# EAGLE design inkubator (EAGLE 9.6.2)
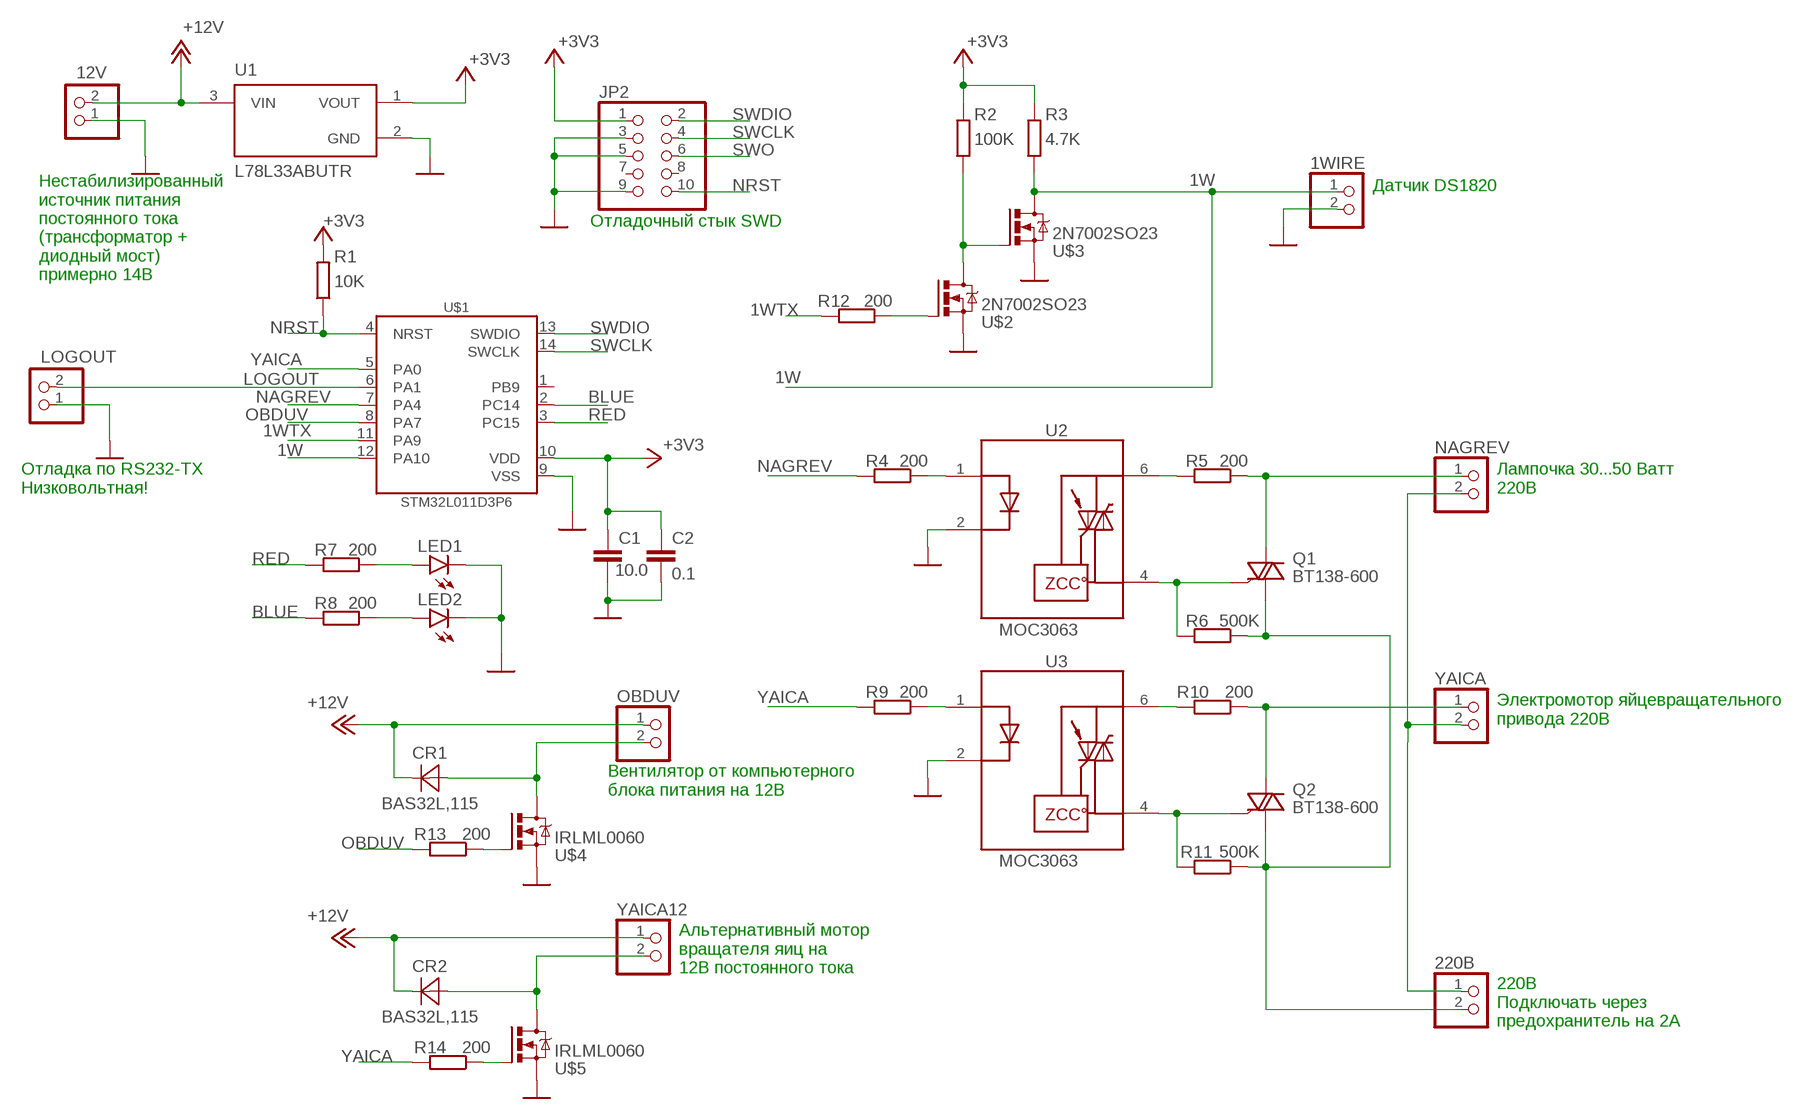
[diagram p0: schematic, sheet 1]

## Parts
1WIRE  PINHD-1X2  [1X02]
12V  PINHD-1X2  [1X02]
220В  PINHD-1X2  [1X02]
C1  10.0  C-EUC1206  [C1206]
C2  0.1  C-EUC1206  [C1206]
CR1  BAS32L,115  [SOD80C]
CR2  BAS32L,115  [SOD80C]
JP2  PINHD-2X5  [2X05]
LED1  LED10MM  [LED10MM]
LED2  LED10MM  [LED10MM]
LOGOUT  PINHD-1X2  [1X02]
NAGREV  PINHD-1X2  [1X02]
OBDUV  PINHD-1X2  [1X02]
Q1  BT138-600  T810-600B-TR  [DPAK]
Q2  BT138-600  T810-600B-TR  [DPAK]
R1  10K  R-EU_R0603  [R0603]
R2  100K  R-EU_R0603  [R0603]
R3  4.7K  R-EU_R0603  [R0603]
R4  200  R-EU_R0603  [R0603]
R5  200  R-EU_R1206  [R1206]
R6  500K  R-EU_R1206  [R1206]
R7  200  R-EU_R0603  [R0603]
R8  200  R-EU_R0603  [R0603]
R9  200  R-EU_R0603  [R0603]
R10  200  R-EU_R1206  [R1206]
R11  500K  R-EU_R1206  [R1206]
R12  200  R-EU_R0603  [R0603]
R13  200  R-EU_R0603  [R0603]
R14  200  R-EU_R0603  [R0603]
U1  L78L33ABUTR  L78L12ABUTR  [VREG_L78L12ABUTR]
U2  MOC3063  VO3062-X017T  [SOIC254P1030X460-6N]
U3  MOC3063  VO3062-X017T  [SOIC254P1030X460-6N]
U$1  STM32L011D3P6  [SOP65P640X120-14N]
U$2  2N7002SO23  [SOT23]
U$3  2N7002SO23  [SOT23]
U$4  IRLML0060  2N7002SO23  [SOT23]
U$5  IRLML0060  2N7002SO23  [SOT23]
YAICA  PINHD-1X2  [1X02]
YAICA12  PINHD-1X2  [1X02]

## Nets
1W: 1WIRE.1 R3.1 U$1.12(PA10) U$3.3(D)
1WTX: R12.2 U$1.11(PA9)
+3V3: C1.1 C2.1 JP2.1 R1.2 R2.2 R3.2 U1.1(VOUT) U$1.10(VDD)
+12V: 12V.2 CR1.1(CATHODE) CR2.1(CATHODE) OBDUV.1 U1.3(VIN) YAICA12.1
BLUE: R8.2 U$1.2(PC14)
GND: 1WIRE.2 12V.1 C1.2 C2.2 JP2.3 JP2.5 JP2.9 LED1.K(C) LED2.K(C) LOGOUT.1 U1.2(GND) U2.2(C) U3.2(C) U$1.9(VSS) U$2.2(S) U$3.2(S) U$4.2(S) U$5.2(S)
LOGOUT: LOGOUT.2 U$1.6(PA1)
N$1: R2.1 U$2.3(D) U$3.1(G)
N$2: R4.1 U2.1(A)
N$3: Q1.3(G) R6.2 U2.4(MT1)
N$4: R5.2 U2.6(MT2)
N$5: NAGREV.1 Q1.2(A2) R5.1
N$6: 220В.1 NAGREV.2 YAICA.2
N$7: R9.1 U3.1(A)
N$8: Q2.3(G) R11.2 U3.4(MT1)
N$9: LED1.A R7.1
N$10: LED2.A R8.1
N$11: R10.2 U3.6(MT2)
N$12: Q2.2(A2) R10.1 YAICA.1
N$13: 220В.2 Q1.1(A1) Q2.1(A1) R6.1 R11.1
N$14: R12.1 U$2.1(G)
N$15: R13.1 U$4.1(G)
N$16: CR1.2(ANODE) OBDUV.2 U$4.3(D)
N$17: R14.1 U$5.1(G)
N$18: CR2.2(ANODE) U$5.3(D) YAICA12.2
NAGREV: R4.2 U$1.7(PA4)
NRST: JP2.10 R1.1 U$1.4(NRST)
OBDUV: R13.2 U$1.8(PA7)
RED: R7.2 U$1.3(PC15)
SWCLK: JP2.4 U$1.14(SWCLK)
SWDIO: JP2.2 U$1.13(SWDIO)
SWO: JP2.6
YAICA: R9.2 R14.2 U$1.5(PA0)
Unconnected: JP2.7 JP2.8 U$1.1(PB9)

## Notes on the sheet
- Датчик DS1820
- Отладочный стык SWD
- Нестабилизированный 
  источник питания 
  постоянного тока
  (трансформатор + 
  диодный мост)
  примерно 14В
- Отладка по RS232-TX
  Низковольтная!
- Лампочка 30...50 Ватт
  220В
- Электромотор яйцевращательного 
  привода 220В
- Вентилятор от компьютерного 
  блока питания на 12В
- Альтернативный мотор 
  вращателя яиц на 
  12В постоянного тока
- 220В
  Подключать через 
  предохранитель на 2А

## Library data of the parts
1WIRE 12V 220В LOGOUT NAGREV OBDUV YAICA YAICA12 = pinhead:PINHD-1X2: PIN HEADER
C1 C2 = resistor:C-EU: CAPACITOR, European symbol
CR1 CR2 = BAS32L_115:BAS32L,115: Check availability <https://pricing.snapeda.com/parts/BAS32L%2C115/Nexperia%20USA/view-part?ref=eda>; AVAILABILITY: In Stock; DESCRIPTION: Diode Standard 75 V 200mA (DC) Surface Mount LLDS; MiniMelf; MF: Nexperia USA; MP: BAS32L,115; PACKAGE: LLDS-2 Nexperia USA Inc.; PRICE: None; PURCHASE-URL: https://pricing.snapeda.com/search/part/BAS32L,115/?ref=eda
JP2 = pinhead:PINHD-2X5: PIN HEADER
LED1 LED2 = led:LED: LED OSRAM: - CHIPLED LG R971, LG N971, LY N971, LG Q971, LY Q971, LO R971, LY R971 LH N974, LH R974 LS Q976, LO Q976, LY Q976 LO Q996 - Hyper CHIPLED LW Q18S LB Q993, LB Q99A, LB R99A - SideLED LS A670, LO A670, LY A670, LG A670, LP A670 LB A673, LV A673, LT A673, LW A673 LH A674 LY A675 LS A676, LA A676, LO A676, LY A676, LW A676 LS A679, LY A679, LG A679 - Hyper Micro SIDELED® LS Y876, LA Y876, LO Y876, LY Y876 LT Y87S - SmartLED LW L88C, LW L88S LB L89C, LB L89S, LG L890 LS L89K, LO L89K, LY L89K LS L896, LA L896, LO L896, LY L896 - TOPLED LS T670, LO T670, LY T670, LG T670, LP T670 LSG T670, LSP T670, LSY T670, LOP T670, LYG T670 LG T671, LOG T671, LSG T671 LB T673, LV T673, LT T673, LW T673 LH T674 LS T676, LA T676, LO T676, LY T676, LB T676, LH T676, LSB T676, LW T676 LB T67C, LV T67C, LT T67C, LS T67K, LO T67K, LY T67K, LW E67C LS E67B, LA E67B, LO E67B, LY E67B, LB E67C, LV E67C, LT E67C LW T67C LS T679, LY T679, LG T679 LS T770, LO T770, LY T770, LG T770, LP T770 LB T773, LV T773, LT T773, LW T773 LH T774 LS E675, LA E675, LY E675, LS T675 LS T776, LA T776, LO T776, LY T776, LB T776 LHGB T686 LT T68C, LB T68C - Hyper Mini TOPLED® LB M676 - Mini TOPLED Santana® LG M470 LS M47K, LO M47K, LY M47K Source: http://www.osram.convergy.de LUXEON: - LUMILED® LXK2-PW12-R00, LXK2-PW12-S00, LXK2-PW14-U00, LXK2-PW14-V00 LXK2-PM12-R00, LXK2-PM12-S00, LXK2-PM14-U00 LXK2-PE12-Q00, LXK2-PE12-R00, LXK2-PE12-S00, LXK2-PE14-T00, LXK2-PE14-U00 LXK2-PB12-K00, LXK2-PB12-L00, LXK2-PB12-M00, LXK2-PB14-N00, LXK2-PB14-P00, LXK2-PB14-Q00 LXK2-PR12-L00, LXK2-PR12-M00, LXK2-PR14-Q00, LXK2-PR14-R00 LXK2-PD12-Q00, LXK2-PD12-R00, LXK2-PD12-S00 LXK2-PH12-R00, LXK2-PH12-S00 LXK2-PL12-P00, LXK2-PL12-Q00, LXK2-PL12-R00 Source: www.luxeon.com KINGBRIGHT: KA-3528ASYC Source: www.kingbright.com
Q1 Q2 = T810-600B-TR:T810-600B-TR: Check availability <https://pricing.snapeda.com/parts/T810-600B-TR/STMicroelectronics/view-part?ref=eda>; AVAILABILITY: In Stock; DESCRIPTION: TRIAC Logic - Sensitive Gate 600 V 8 A Surface Mount DPAK; MF: STMicroelectronics; MP: T810-600B-TR; PACKAGE: TO-252 STMicroelectronics; PRICE: None; PURCHASE-URL: https://pricing.snapeda.com/search/part/T810-600B-TR/?ref=eda
R1-R14 = resistor:R-EU_: RESISTOR, European symbol
U1 = L78L12ABUTR:L78L12ABUTR: Linear Voltage Regulator IC 1 Output 100mA SOT-89-3 Check availability <https://pricing.snapeda.com/parts/L78L12ABUTR/STMicroelectronics/view-part?ref=eda>; AVAILABILITY: In Stock; DESCRIPTION: Linear Voltage Regulator IC Positive Fixed 1 Output 100mA SOT-89-3; MF: STMicroelectronics; MP: L78L12ABUTR; PACKAGE: SOT-89-3 STMicroelectronics; PRICE: None; PURCHASE-URL: https://pricing.snapeda.com/search/part/L78L12ABUTR/?ref=eda
U2 U3 = VO3062-X017T:VO3062-X017T: Phototriac, Zero Crossing, 1.5 kV/μs dV/dt, 600 V Check availability <https://pricing.snapeda.com/parts/VO3062-X017T/Vishay%20Semiconductor/view-part?ref=eda>; AVAILABILITY: In Stock; DESCRIPTION: Optoisolator Triac Output 5300Vrms 1 Channel 6-SMD; MF: Vishay Semiconductor; MP: VO3062-X017T; PACKAGE: SMD-6 Vishay Semiconductor; PRICE: None; PURCHASE-URL: https://pricing.snapeda.com/search/part/VO3062-X017T/?ref=eda
U$1 = stm32l011d3p6:STM32L011D3P6
U$2-U$5 = 2n7002:2N7002

## Board
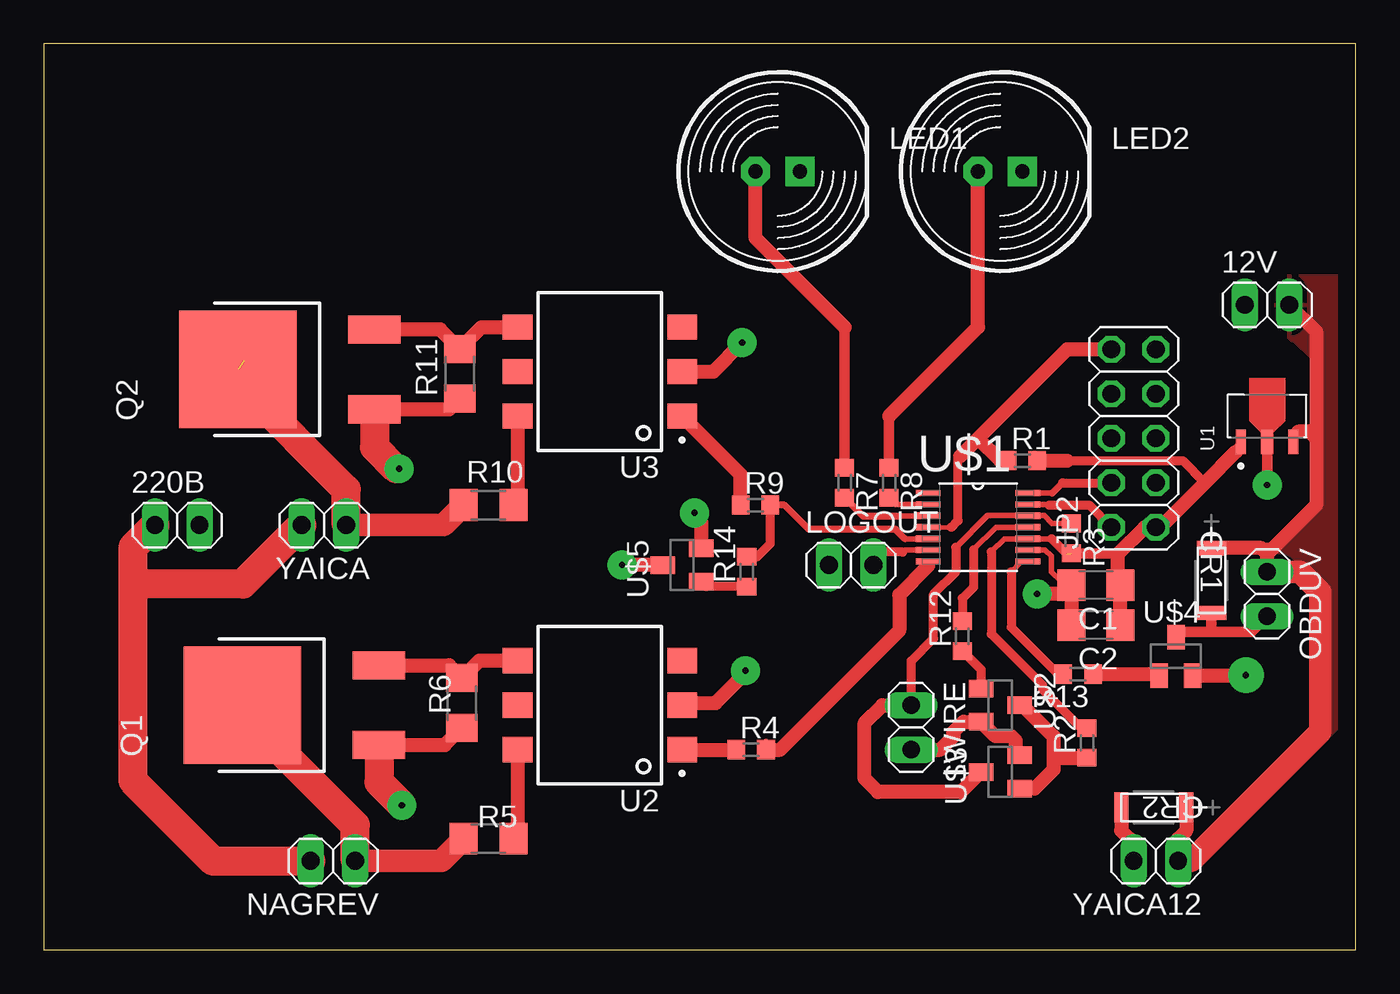
[diagram p1: board, top side]
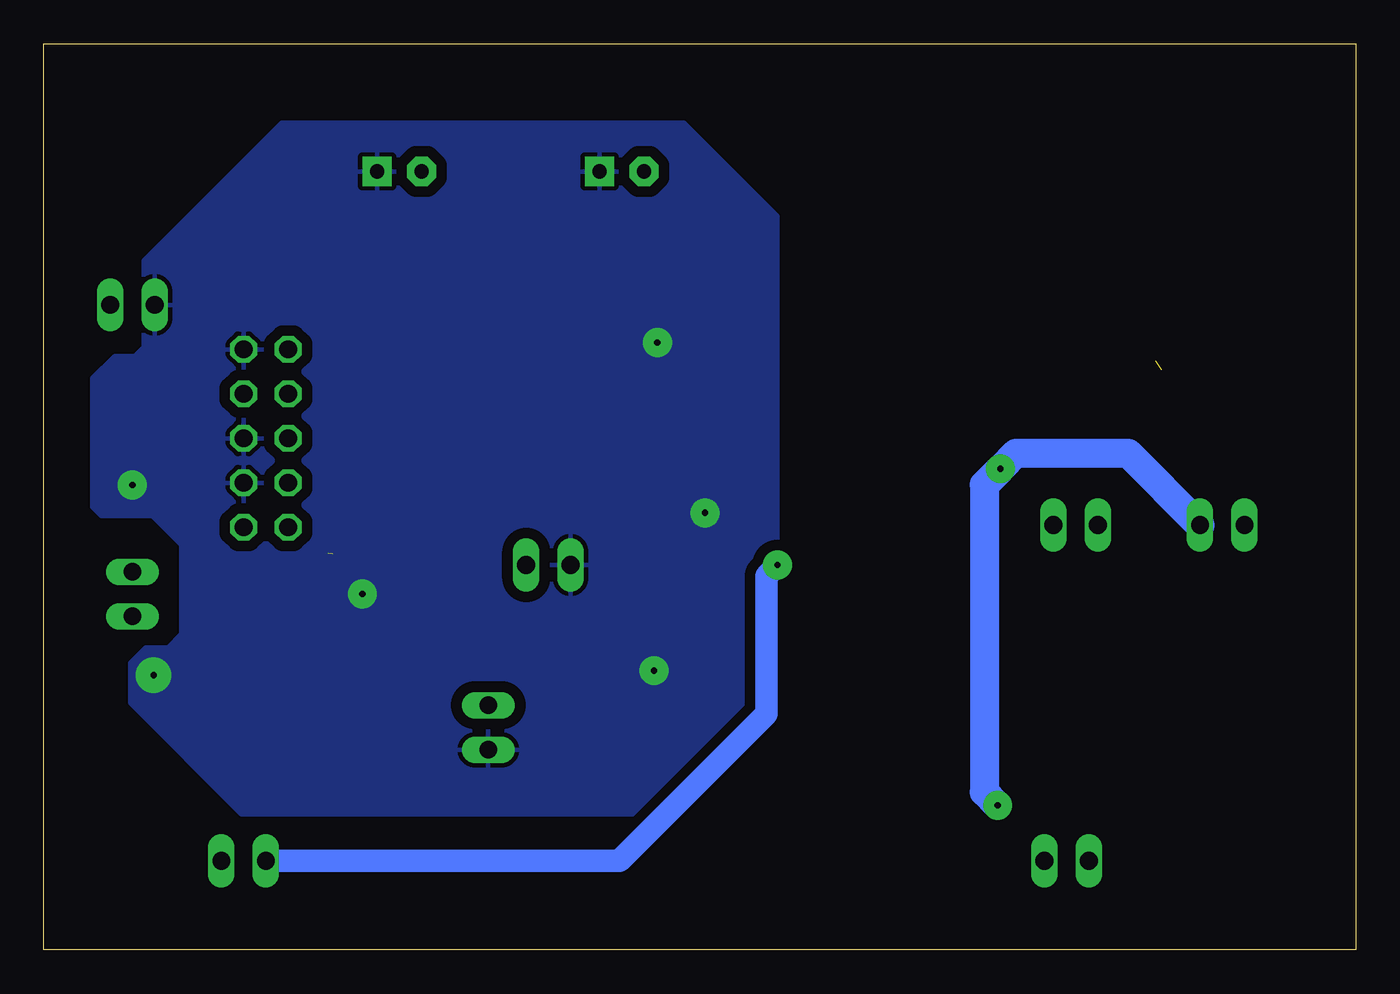
[diagram p2: board, bottom side, seen from below]

Size 74.91 x 51.74 mm. Coordinates in mm from the lower left corner, seen from the top.
Outline: 0,0 74.91,0 74.91,51.74 0,51.74 0,0
Copper layers (1*16): Top 0.035mm / dielectric 1.5mm / Bottom 0.035mm
Design rules "default": minimum track width 6mil, minimum drill 0.35mm, track to track 6mil, track to pad 6mil, pad to pad 6mil, via to via 6mil, smd to smd 6mil, copper to edge 40mil, drill to drill 6mil, minimum pad ring 10mil, minimum via ring 8mil, stop-mask expansion 4mil, vias tented up to drill 0mil, thermal gap 10mil

### Footprints (pad centres in the part's own frame; a part is rotated, then mirrored left to right if it is on the bottom)
1X02 = drill 1.016 long: 1 -1.27,0; 2 1.27,0
C1206 = smd 1.6 x 1.8: 1 -1.4,0; 2 1.4,0
SOD80C = smd 0.813 x 1.702: 1 -1.852,0; 2 1.852,0
2X05 = drill 1.016 octagon: 1 -5.08,-1.27; 2 -5.08,1.27; 3 -2.54,-1.27; 4 -2.54,1.27; 5 0,-1.27; 6 0,1.27; 7 2.54,-1.27; 8 2.54,1.27; 9 5.08,-1.27; 10 5.08,1.27
LED10MM = drill 0.813 pad 1.676 octagon: A -1.27,0 | drill 0.813 pad 1.676 square: K 1.27,0
DPAK = smd 1.6 x 3: 1 -2.28,-3.9; 3 2.28,-3.9 | smd 6.7 x 6.7: 2 0,3.9
R0603 = smd 1 x 1.1: 1 -0.85,0; 2 0.85,0
R1206 = smd 1.6 x 1.803: 1 -1.422,0; 2 1.422,0
VREG_L78L12ABUTR = smd 1.4 x 0.57: 1 -1.475,1.5; 3 -1.475,-1.5 | smd 1.4 x 0.65: 2 -1.475,0
SOIC254P1030X460-6N = smd 1.7 x 1.45: 1 -4.7,2.54; 2 -4.7,0; 3 -4.7,-2.54; 4 4.7,-2.54; 5 4.7,0; 6 4.7,2.54
SOP65P640X120-14N = smd 1.422 x 0.356: 1 -2.845,1.956; 2 -2.845,1.295; 3 -2.845,0.66; 4 -2.845,0; 5 -2.845,-0.66; 6 -2.845,-1.295; 7 -2.845,-1.956; 8 2.845,-1.956; 9 2.845,-1.295; 10 2.845,-0.66; 11 2.845,0; 12 2.845,0.66; 13 2.845,1.295; 14 2.845,1.956
SOT23 = smd 1 x 1.4: 1 -0.95,-1.1; 2 0.95,-1.1; 3 0,1.1

### Placement (x,y rotation side)
1WIRE  49.53,12.7 270 top
12V  69.85,36.83 0 top
220В  7.62,24.26 0 top
C1  60.07,20.83 180 top
C2  60.07,18.54 180 top
CR1  66.67,21.08 270 top
CR2  63.37,8.13 180 top
JP2  62.23,29.21 90 top
LED1  41.91,44.45 0 top
LED2  54.61,44.45 0 top
LOGOUT  46.1,21.97 0 top
NAGREV  16.51,5.08 180 top
OBDUV  69.85,20.32 270 top
Q1  15.24,13.97 90 top
Q2  14.99,33.15 90 top
R1  55.88,27.94 0 top
R2  59.56,11.81 90 top
R3  58.67,23.5 270 top
R4  40.39,11.43 0 top
R5  25.4,6.35 0 top
R6  23.88,14.1 90 top
R7  45.72,26.67 270 top
R8  48.26,26.67 270 top
R9  40.64,25.4 0 top
R10  25.4,25.4 0 top
R11  23.75,32.89 90 top
R12  52.45,17.91 90 top
R13  59.05,15.75 180 top
R14  40.13,21.59 90 top
U1  69.85,30.48 90 top
U2  31.75,13.97 180 top
U3  31.75,33.02 180 top
U$1  53.34,24.13 0 top
U$2  54.61,13.97 270 top
U$3  54.61,10.16 90 top
U$4  64.64,16.76 0 top
U$5  36.45,21.97 90 top
YAICA  16,24.26 180 top
YAICA12  63.5,5.08 180 top

### Tracks (layer width: path | path; a pad name or v marks a point on that pad's centre or on a via)
1W
  Top 0.305: 52.07,22.99 53.87,24.79 U$1.12 57.12,24.79 57.57,24.34 R3.1
  Top 0.508: 52.07,22.99 52.07,21.59 50.8,20.32 50.8,17.78 49.53,16.51 1WIRE.1
  Top 0.813: U$3.3 52.37,9.02 47.62,9.02 46.86,9.78 46.86,12.95 47.88,13.97 1WIRE.1
1WTX
  Top 0.305: U$1.11 54.36,24.13 53.09,22.86
  Top 0.508: 53.09,22.86 53.09,20.7 52.45,20.07 R12.2
+3V3  (1 unrouted)
  Top 0.254: U1.1 68.07,28.73 68.07,28.45
  Top 0.305: 57.56,23.47 U$1.10 54.84,23.47 54.1,22.73 | 59.22,12.66 R2.2
  Top 0.508: 57.56,23.47 58.42,22.61 | 58.42,27.94 65.02,27.94 66.29,26.67 | 54.1,22.73 54.1,18.03 57.02,15.11 57.02,14.86 59.22,12.66
  Top 0.61: R3.2 61.3,22.64 61.34,22.61
  Top 0.813: 68.07,28.45 66.29,26.67 63.75,24.13 JP2.1 62.87,24.13 61.34,22.61 61.34,20.96 C1.1 C2.1 | R1.2 58.42,27.94
+12V
  Top 0.254: U1.3 71.35,29.31 71.63,29.59
  Top 0.813: OBDUV.1 69.85,22.61 | 69.85,22.61 69.52,22.93 CR1.1 | 69.85,22.61 69.85,22.86 | 12V.2 72.64,35.31 72.64,29.21 | 69.85,22.61 72.64,25.4 72.64,29.21 | 72.64,29.21 72.26,29.59 71.63,29.59 | CR2.1 65.22,6.8 64.77,6.35 YAICA12.1
  Top 1.27: YAICA12.1 65.53,5.08 72.9,12.45 72.9,20.45 71.75,21.59 OBDUV.1
  pour Top: 70.36,38.48 75.06,38.48 75.18,38.35 75.18,13.97 73.28,12.06 73.28,19.94 72.64,20.57 71.63,21.59 69.98,21.59 69.98,22.73 72.39,25.15 72.39,33.78 71.37,34.8 71.25,34.8 70.87,35.18 70.48,35.18 70.36,35.31
BLUE
  Top 0.305: U$1.2 48.66,25.43 R8.2
GND  (via drill 0.35 pad 1.65, 0.35 pad 2.03)
  Top 0.305: U$1.9 57.17,22.84 57.53,22.48 57.53,21.59 58.04,21.08 58.67,21.08 | 58.67,21.34 58.67,21.08 | 58.67,21.08 C1.2
  Top 0.61: U1.2 v69.85,26.54
  Top 0.813: v39.88,34.67 38.23,33.02 U3.2 | C1.2 58.67,20.32 | 58.67,20.32 C2.2 | 58.67,20.32 v56.72,20.32 56.64,20.32 | U$4.2 68.54,15.66 68.58,15.62 v68.64,15.68 | U2.2 36.58,14.1 38.35,14.1 40.13,15.88 v40.07,15.94 | U$3.2 55.5,11.32 55.5,11.94 55.24,12.19 54.34,12.19 U$2.2 52.52,13.02 51.94,12.45 51.94,12.19 51.18,11.43 1WIRE.2 | U$5.2 37.55,24.43 37.08,24.89 v37.15,24.96
  pour Bottom (isolate 0.61): 33.02,41.91 33.02,7.75 63.63,7.75 69.98,14.1 69.98,16.38 69.09,17.27 67.82,17.27 67.06,18.03 67.06,23.11 68.71,24.77 71.63,24.77 72.14,25.27 72.14,32.64 70.87,33.91 69.72,33.91 69.22,34.42 69.22,39.37 61.34,47.24 38.35,47.24
LOGOUT
  Top 0.305: U$1.6 49.17,22.84 49.05,22.71
  Top 0.508: LOGOUT.2 47.37,22.48 47.6,22.71 49.05,22.71
N$1
  Top 0.813: U$2.3 55.88,13.97 57.66,12.19 57.66,10.92 | U$3.1 56.58,9.21 57.66,10.29 57.66,10.92 | R2.1 59.52,10.92 57.66,10.92
N$2
  Top 0.813: U2.1 R4.1
N$3
  Top 0.813: U2.4 24.87,16.51 R6.2 23.14,16.25 Q1.3
N$4
  Top 0.813: U2.6 27.05,6.58 R5.2
N$5
  Top 1.27: 11.34,12.66 Q1.2 11.34,13.55 | NAGREV.1 22.71,5.08 R5.1
  Top 1.651: NAGREV.1 17.78,7.11 11.34,13.55
N$6
  Top 1.651: 5.08,20.89 5.08,9.65 9.65,5.08 NAGREV.2 | YAICA.2 12.38,21.91 11.37,20.89 5.08,20.89 | 220В.1 5.08,22.99 5.08,20.89
N$7
  Top 0.813: R9.1 39.79,27.14 U3.1
N$8
  Top 0.813: Q2.3 22.64,35.43 R11.2 24.99,35.56 U3.4
N$9
  Top 0.61: R7.1 45.72,35.56
  Top 0.813: 45.72,35.56 40.64,40.64 LED1.A
N$10
  Top 0.61: R8.1 48.26,30.48
  Top 0.813: 48.26,30.48 53.34,35.56 LED2.A
N$11
  Top 0.813: U3.6 27.05,25.63 R10.2
N$12  (1 unrouted)
  Top 1.27: YAICA.1 22.84,24.26 R10.1 | 11.43,32.13 11.43,33.66
  Top 1.651: YAICA.1 17.27,26.29 11.43,32.13
N$13  (via drill 0.35 pad 1.65)
  Top 0.813: R11.1 23.14,30.87 Q2.1 19.05,30.7 | Q1.1 22.89,11.69 R6.1
  Top 1.016: 19.05,11.6 Q1.1
  Top 1.27: 20.12,27.47 v20.28,27.47 20.32,27.43
  Top 1.651: Q2.1 18.89,28.71 20.12,27.47 | Q1.1 19.14,9.56 v20.45,8.26
  Bottom 1.651: 220В.2 12.99,28.36 19.39,28.36 v20.28,27.47 21.21,26.54 21.21,9.02 v20.45,8.26
N$14
  Top 0.508: R12.1 53.51,16 U$2.1
N$15
  Top 0.813: R13.1 63.61,15.75 U$4.1
N$16
  Top 0.61: U$4.3 64.94,18.16 66.67,18.16 | OBDUV.2 68.96,18.16 66.67,18.16 | CR1.2 66.67,18.16
N$17
  Top 0.508: R14.1 37.83,20.74 U$5.1
N$18  (via drill 0.35 pad 1.65)
  Top 0.813: U$5.3 v33.02,21.97 | CR2.2 61.52,6.8 62.23,6.1 YAICA12.2
  Bottom 1.27: v33.02,21.97 33.66,21.34 33.66,13.46 42.04,5.08 YAICA12.2
NAGREV
  Top 0.305: 50.49,21.92 U$1.7 | 41.24,11.9 R4.2
  Top 0.813: R4.2 42.04,11.43 48.84,18.24 48.84,20.27 50.49,21.92
NRST
  Top 0.254: U$1.4 51.82,24.13
  Top 0.305: 52.2,28.07 52.32,28.19
  Top 0.508: R1.1 54.86,28.11 | 51.82,24.13 52.2,24.51 52.2,28.07
  Top 0.813: JP2.10 58.42,34.29 53.34,29.21 | 52.32,28.19 53.34,29.21 | R1.1 54.61,27.94 53.34,29.21
OBDUV
  Top 0.305: U$1.8 55.83,22.17 55.24,21.59
  Top 0.508: 55.24,21.59 55.24,18.41 57.91,15.75
  Top 0.61: R13.2 57.91,15.75
RED
  Top 0.305: 48.9,24.77 50.47,24.77 U$1.3
  Top 0.406: R7.2 46.77,24.77 48.9,24.77
SWCLK
  Top 0.305: U$1.14 57.58,26.09
  Top 0.406: 57.58,26.09 58.17,26.67
  Top 0.508: 58.17,26.67 JP2.4
SWDIO
  Top 0.305: U$1.13 57.38,25.43
  Top 0.406: 57.38,25.43 57.4,25.4
  Top 0.508: JP2.2 59.69,25.4 57.4,25.4
YAICA
  Top 0.305: U$1.5 49.17,23.47
  Top 0.406: R9.2 42.29,25.4 43.69,24 48.64,24 49.17,23.47
  Top 0.508: R14.2 40.73,22.44 41.49,23.2 R9.2